# Altium schematic sheet Sensor_ExpandBoard_LED.SchDoc: Sencor Card
size A3; Revision: V1.1; SheetNumber: 2; SheetTotal: 7; Function: LED Matrix
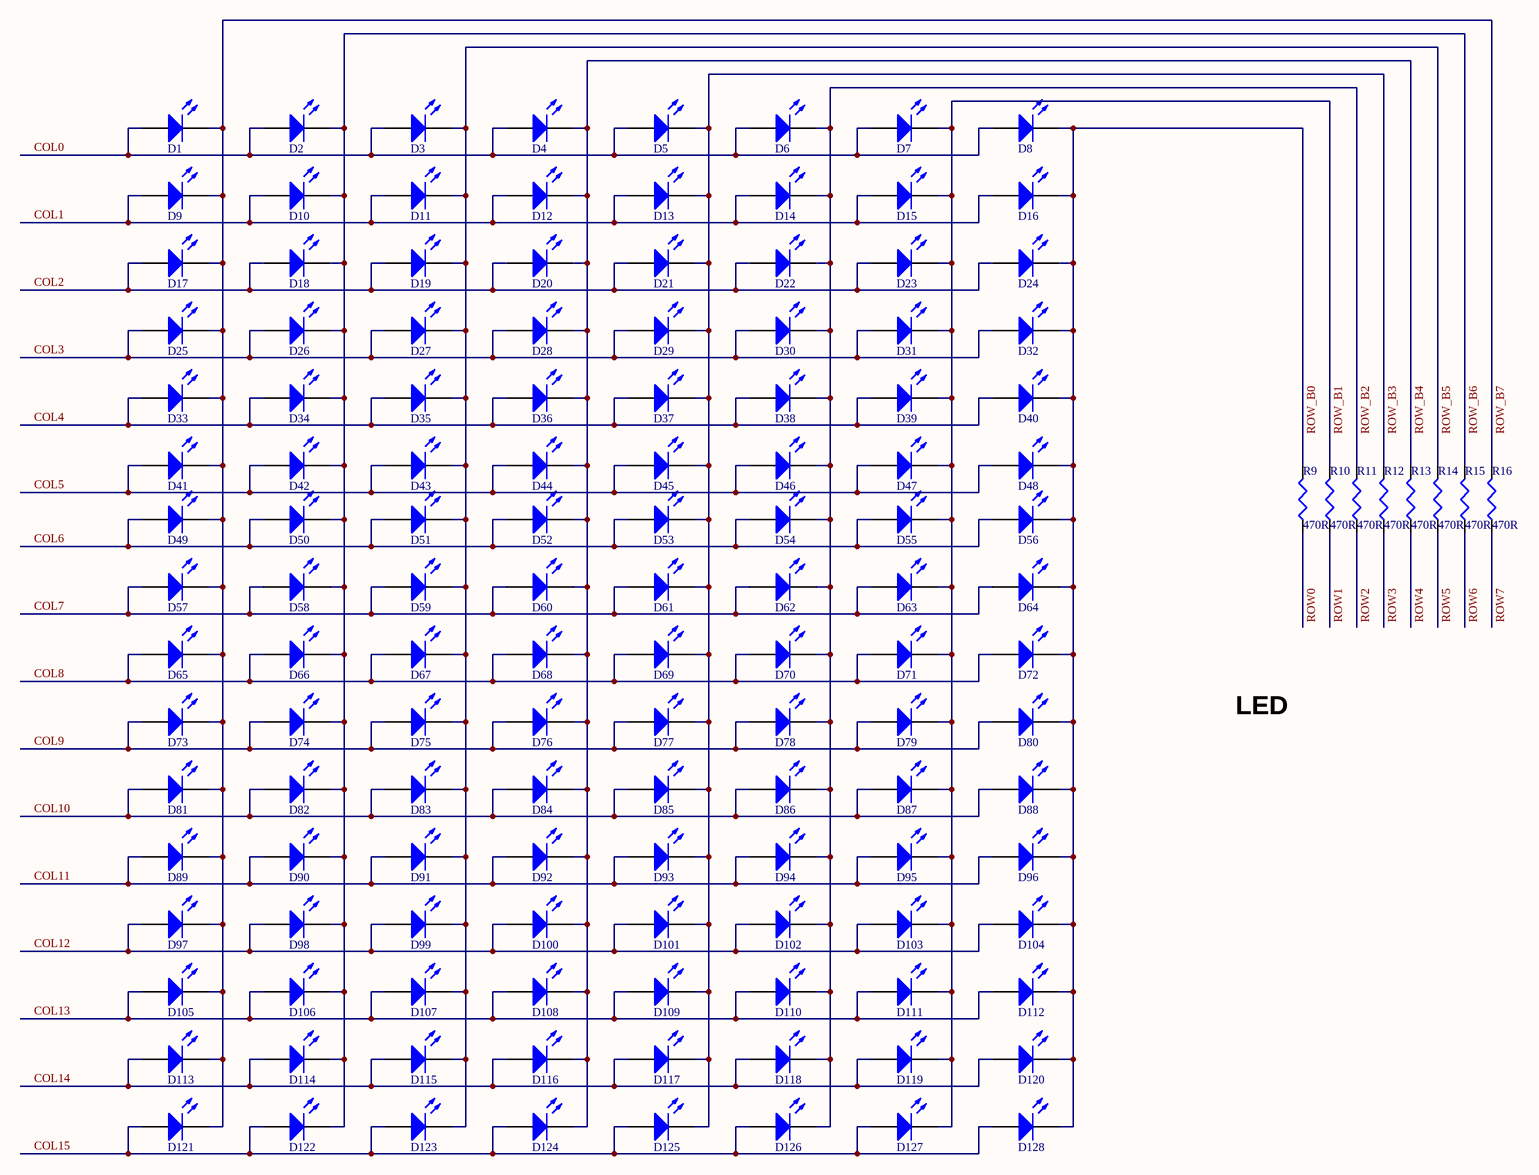
[diagram p0: Sensor_ExpandBoard_LED.SchDoc]

## Parts
D1  Red  [LED_0603_SMALL]  (value not drawn)
D2  Red  [LED_0603_SMALL]  (value not drawn)
D3  Red  [LED_0603_SMALL]  (value not drawn)
D4  Red  [LED_0603_SMALL]  (value not drawn)
D5  Red  [LED_0603_SMALL]  (value not drawn)
D6  Red  [LED_0603_SMALL]  (value not drawn)
D7  Red  [LED_0603_SMALL]  (value not drawn)
D8  Red  [LED_0603_SMALL]  (value not drawn)
D9  Red  [LED_0603_SMALL]  (value not drawn)
D10  Red  [LED_0603_SMALL]  (value not drawn)
D11  Red  [LED_0603_SMALL]  (value not drawn)
D12  Red  [LED_0603_SMALL]  (value not drawn)
D13  Red  [LED_0603_SMALL]  (value not drawn)
D14  Red  [LED_0603_SMALL]  (value not drawn)
D15  Red  [LED_0603_SMALL]  (value not drawn)
D16  Red  [LED_0603_SMALL]  (value not drawn)
D17  Red  [LED_0603_SMALL]  (value not drawn)
D18  Red  [LED_0603_SMALL]  (value not drawn)
D19  Red  [LED_0603_SMALL]  (value not drawn)
D20  Red  [LED_0603_SMALL]  (value not drawn)
D21  Red  [LED_0603_SMALL]  (value not drawn)
D22  Red  [LED_0603_SMALL]  (value not drawn)
D23  Red  [LED_0603_SMALL]  (value not drawn)
D24  Red  [LED_0603_SMALL]  (value not drawn)
D25  Red  [LED_0603_SMALL]  (value not drawn)
D26  Red  [LED_0603_SMALL]  (value not drawn)
D27  Red  [LED_0603_SMALL]  (value not drawn)
D28  Red  [LED_0603_SMALL]  (value not drawn)
D29  Red  [LED_0603_SMALL]  (value not drawn)
D30  Red  [LED_0603_SMALL]  (value not drawn)
D31  Red  [LED_0603_SMALL]  (value not drawn)
D32  Red  [LED_0603_SMALL]  (value not drawn)
D33  Red  [LED_0603_SMALL]  (value not drawn)
D34  Red  [LED_0603_SMALL]  (value not drawn)
D35  Red  [LED_0603_SMALL]  (value not drawn)
D36  Red  [LED_0603_SMALL]  (value not drawn)
D37  Red  [LED_0603_SMALL]  (value not drawn)
D38  Red  [LED_0603_SMALL]  (value not drawn)
D39  Red  [LED_0603_SMALL]  (value not drawn)
D40  Red  [LED_0603_SMALL]  (value not drawn)
D41  Red  [LED_0603_SMALL]  (value not drawn)
D42  Red  [LED_0603_SMALL]  (value not drawn)
D43  Red  [LED_0603_SMALL]  (value not drawn)
D44  Red  [LED_0603_SMALL]  (value not drawn)
D45  Red  [LED_0603_SMALL]  (value not drawn)
D46  Red  [LED_0603_SMALL]  (value not drawn)
D47  Red  [LED_0603_SMALL]  (value not drawn)
D48  Red  [LED_0603_SMALL]  (value not drawn)
D49  Red  [LED_0603_SMALL]  (value not drawn)
D50  Red  [LED_0603_SMALL]  (value not drawn)
D51  Red  [LED_0603_SMALL]  (value not drawn)
D52  Red  [LED_0603_SMALL]  (value not drawn)
D53  Red  [LED_0603_SMALL]  (value not drawn)
D54  Red  [LED_0603_SMALL]  (value not drawn)
D55  Red  [LED_0603_SMALL]  (value not drawn)
D56  Red  [LED_0603_SMALL]  (value not drawn)
D57  Red  [LED_0603_SMALL]  (value not drawn)
D58  Red  [LED_0603_SMALL]  (value not drawn)
D59  Red  [LED_0603_SMALL]  (value not drawn)
D60  Red  [LED_0603_SMALL]  (value not drawn)
D61  Red  [LED_0603_SMALL]  (value not drawn)
D62  Red  [LED_0603_SMALL]  (value not drawn)
D63  Red  [LED_0603_SMALL]  (value not drawn)
D64  Red  [LED_0603_SMALL]  (value not drawn)
D65  Red  [LED_0603_SMALL]  (value not drawn)
D66  Red  [LED_0603_SMALL]  (value not drawn)
D67  Red  [LED_0603_SMALL]  (value not drawn)
D68  Red  [LED_0603_SMALL]  (value not drawn)
D69  Red  [LED_0603_SMALL]  (value not drawn)
D70  Red  [LED_0603_SMALL]  (value not drawn)
D71  Red  [LED_0603_SMALL]  (value not drawn)
D72  Red  [LED_0603_SMALL]  (value not drawn)
D73  Red  [LED_0603_SMALL]  (value not drawn)
D74  Red  [LED_0603_SMALL]  (value not drawn)
D75  Red  [LED_0603_SMALL]  (value not drawn)
D76  Red  [LED_0603_SMALL]  (value not drawn)
D77  Red  [LED_0603_SMALL]  (value not drawn)
D78  Red  [LED_0603_SMALL]  (value not drawn)
D79  Red  [LED_0603_SMALL]  (value not drawn)
D80  Red  [LED_0603_SMALL]  (value not drawn)
D81  Red  [LED_0603_SMALL]  (value not drawn)
D82  Red  [LED_0603_SMALL]  (value not drawn)
D83  Red  [LED_0603_SMALL]  (value not drawn)
D84  Red  [LED_0603_SMALL]  (value not drawn)
D85  Red  [LED_0603_SMALL]  (value not drawn)
D86  Red  [LED_0603_SMALL]  (value not drawn)
D87  Red  [LED_0603_SMALL]  (value not drawn)
D88  Red  [LED_0603_SMALL]  (value not drawn)
D89  Red  [LED_0603_SMALL]  (value not drawn)
D90  Red  [LED_0603_SMALL]  (value not drawn)
D91  Red  [LED_0603_SMALL]  (value not drawn)
D92  Red  [LED_0603_SMALL]  (value not drawn)
D93  Red  [LED_0603_SMALL]  (value not drawn)
D94  Red  [LED_0603_SMALL]  (value not drawn)
D95  Red  [LED_0603_SMALL]  (value not drawn)
D96  Red  [LED_0603_SMALL]  (value not drawn)
D97  Red  [LED_0603_SMALL]  (value not drawn)
D98  Red  [LED_0603_SMALL]  (value not drawn)
D99  Red  [LED_0603_SMALL]  (value not drawn)
D100  Red  [LED_0603_SMALL]  (value not drawn)
D101  Red  [LED_0603_SMALL]  (value not drawn)
D102  Red  [LED_0603_SMALL]  (value not drawn)
D103  Red  [LED_0603_SMALL]  (value not drawn)
D104  Red  [LED_0603_SMALL]  (value not drawn)
D105  Red  [LED_0603_SMALL]  (value not drawn)
D106  Red  [LED_0603_SMALL]  (value not drawn)
D107  Red  [LED_0603_SMALL]  (value not drawn)
D108  Red  [LED_0603_SMALL]  (value not drawn)
D109  Red  [LED_0603_SMALL]  (value not drawn)
D110  Red  [LED_0603_SMALL]  (value not drawn)
D111  Red  [LED_0603_SMALL]  (value not drawn)
D112  Red  [LED_0603_SMALL]  (value not drawn)
D113  Red  [LED_0603_SMALL]  (value not drawn)
D114  Red  [LED_0603_SMALL]  (value not drawn)
D115  Red  [LED_0603_SMALL]  (value not drawn)
D116  Red  [LED_0603_SMALL]  (value not drawn)
D117  Red  [LED_0603_SMALL]  (value not drawn)
D118  Red  [LED_0603_SMALL]  (value not drawn)
D119  Red  [LED_0603_SMALL]  (value not drawn)
D120  Red  [LED_0603_SMALL]  (value not drawn)
D121  Red  [LED_0603_SMALL]  (value not drawn)
D122  Red  [LED_0603_SMALL]  (value not drawn)
D123  Red  [LED_0603_SMALL]  (value not drawn)
D124  Red  [LED_0603_SMALL]  (value not drawn)
D125  Red  [LED_0603_SMALL]  (value not drawn)
D126  Red  [LED_0603_SMALL]  (value not drawn)
D127  Red  [LED_0603_SMALL]  (value not drawn)
D128  Red  [LED_0603_SMALL]  (value not drawn)
R9  470R  [R0603]
R10  470R  [R0603]
R11  470R  [R0603]
R12  470R  [R0603]
R13  470R  [R0603]
R14  470R  [R0603]
R15  470R  [R0603]
R16  470R  [R0603]

## Nets
COL0: D1.1(A) D2.1(A) D3.1(A) D4.1(A) D5.1(A) D6.1(A) D7.1(A) D8.1(A)
COL1: D9.1(A) D10.1(A) D11.1(A) D12.1(A) D13.1(A) D14.1(A) D15.1(A) D16.1(A)
COL2: D17.1(A) D18.1(A) D19.1(A) D20.1(A) D21.1(A) D22.1(A) D23.1(A) D24.1(A)
COL3: D25.1(A) D26.1(A) D27.1(A) D28.1(A) D29.1(A) D30.1(A) D31.1(A) D32.1(A)
COL4: D33.1(A) D34.1(A) D35.1(A) D36.1(A) D37.1(A) D38.1(A) D39.1(A) D40.1(A)
COL5: D41.1(A) D42.1(A) D43.1(A) D44.1(A) D45.1(A) D46.1(A) D47.1(A) D48.1(A)
COL6: D49.1(A) D50.1(A) D51.1(A) D52.1(A) D53.1(A) D54.1(A) D55.1(A) D56.1(A)
COL7: D57.1(A) D58.1(A) D59.1(A) D60.1(A) D61.1(A) D62.1(A) D63.1(A) D64.1(A)
COL8: D65.1(A) D66.1(A) D67.1(A) D68.1(A) D69.1(A) D70.1(A) D71.1(A) D72.1(A)
COL9: D73.1(A) D74.1(A) D75.1(A) D76.1(A) D77.1(A) D78.1(A) D79.1(A) D80.1(A)
COL10: D81.1(A) D82.1(A) D83.1(A) D84.1(A) D85.1(A) D86.1(A) D87.1(A) D88.1(A)
COL11: D89.1(A) D90.1(A) D91.1(A) D92.1(A) D93.1(A) D94.1(A) D95.1(A) D96.1(A)
COL12: D97.1(A) D98.1(A) D99.1(A) D100.1(A) D101.1(A) D102.1(A) D103.1(A) D104.1(A)
COL13: D105.1(A) D106.1(A) D107.1(A) D108.1(A) D109.1(A) D110.1(A) D111.1(A) D112.1(A)
COL14: D113.1(A) D114.1(A) D115.1(A) D116.1(A) D117.1(A) D118.1(A) D119.1(A) D120.1(A)
COL15: D121.1(A) D122.1(A) D123.1(A) D124.1(A) D125.1(A) D126.1(A) D127.1(A) D128.1(A)
ROW0: R9.1
ROW1: R10.1
ROW2: R11.1
ROW3: R12.1
ROW4: R13.1
ROW5: R14.1
ROW6: R15.1
ROW7: R16.1
ROW_B0: D8.2(K) D16.2(K) D24.2(K) D32.2(K) D40.2(K) D48.2(K) D56.2(K) D64.2(K) D72.2(K) D80.2(K) D88.2(K) D96.2(K) D104.2(K) D112.2(K) D120.2(K) D128.2(K) R9.2
ROW_B1: D7.2(K) D15.2(K) D23.2(K) D31.2(K) D39.2(K) D47.2(K) D55.2(K) D63.2(K) D71.2(K) D79.2(K) D87.2(K) D95.2(K) D103.2(K) D111.2(K) D119.2(K) D127.2(K) R10.2
ROW_B2: D6.2(K) D14.2(K) D22.2(K) D30.2(K) D38.2(K) D46.2(K) D54.2(K) D62.2(K) D70.2(K) D78.2(K) D86.2(K) D94.2(K) D102.2(K) D110.2(K) D118.2(K) D126.2(K) R11.2
ROW_B3: D5.2(K) D13.2(K) D21.2(K) D29.2(K) D37.2(K) D45.2(K) D53.2(K) D61.2(K) D69.2(K) D77.2(K) D85.2(K) D93.2(K) D101.2(K) D109.2(K) D117.2(K) D125.2(K) R12.2
ROW_B4: D4.2(K) D12.2(K) D20.2(K) D28.2(K) D36.2(K) D44.2(K) D52.2(K) D60.2(K) D68.2(K) D76.2(K) D84.2(K) D92.2(K) D100.2(K) D108.2(K) D116.2(K) D124.2(K) R13.2
ROW_B5: D3.2(K) D11.2(K) D19.2(K) D27.2(K) D35.2(K) D43.2(K) D51.2(K) D59.2(K) D67.2(K) D75.2(K) D83.2(K) D91.2(K) D99.2(K) D107.2(K) D115.2(K) D123.2(K) R14.2
ROW_B6: D2.2(K) D10.2(K) D18.2(K) D26.2(K) D34.2(K) D42.2(K) D50.2(K) D58.2(K) D66.2(K) D74.2(K) D82.2(K) D90.2(K) D98.2(K) D106.2(K) D114.2(K) D122.2(K) R15.2
ROW_B7: D1.2(K) D9.2(K) D17.2(K) D25.2(K) D33.2(K) D41.2(K) D49.2(K) D57.2(K) D65.2(K) D73.2(K) D81.2(K) D89.2(K) D97.2(K) D105.2(K) D113.2(K) D121.2(K) R16.2

## Notes on the sheet
- LED
- 工程名称：
- 图纸大小：
- 日期：
- A3
- 版本号：
- 页码：
- 第
- 共
- 制图：
- 审核：

## Library data of the parts
D1-D128 = LED0: 发光二极管; Published: 8-Jun-2000; LatestRevisionDate: 08-Jul-2005; LatestRevisionNote: Mech Layer 1 removed.; PackageReference: LED-0; Publisher: Altium Limited; Value: Red
R9-R16 = Res: Resistor; Published: 8-Jun-2000; LatestRevisionDate: 29-May-2009; LatestRevisionNote: IPC-7351 Footprint Added.; PackageReference: J1-0603; Publisher: Altium Limited; Value: 470R; PackageDescription: Chip Resistor